# Altium schematic sheet HZSneckV1.2.SchDoc
size 381 x 241 mm; SheetNumber: 1; SheetTotal: 1
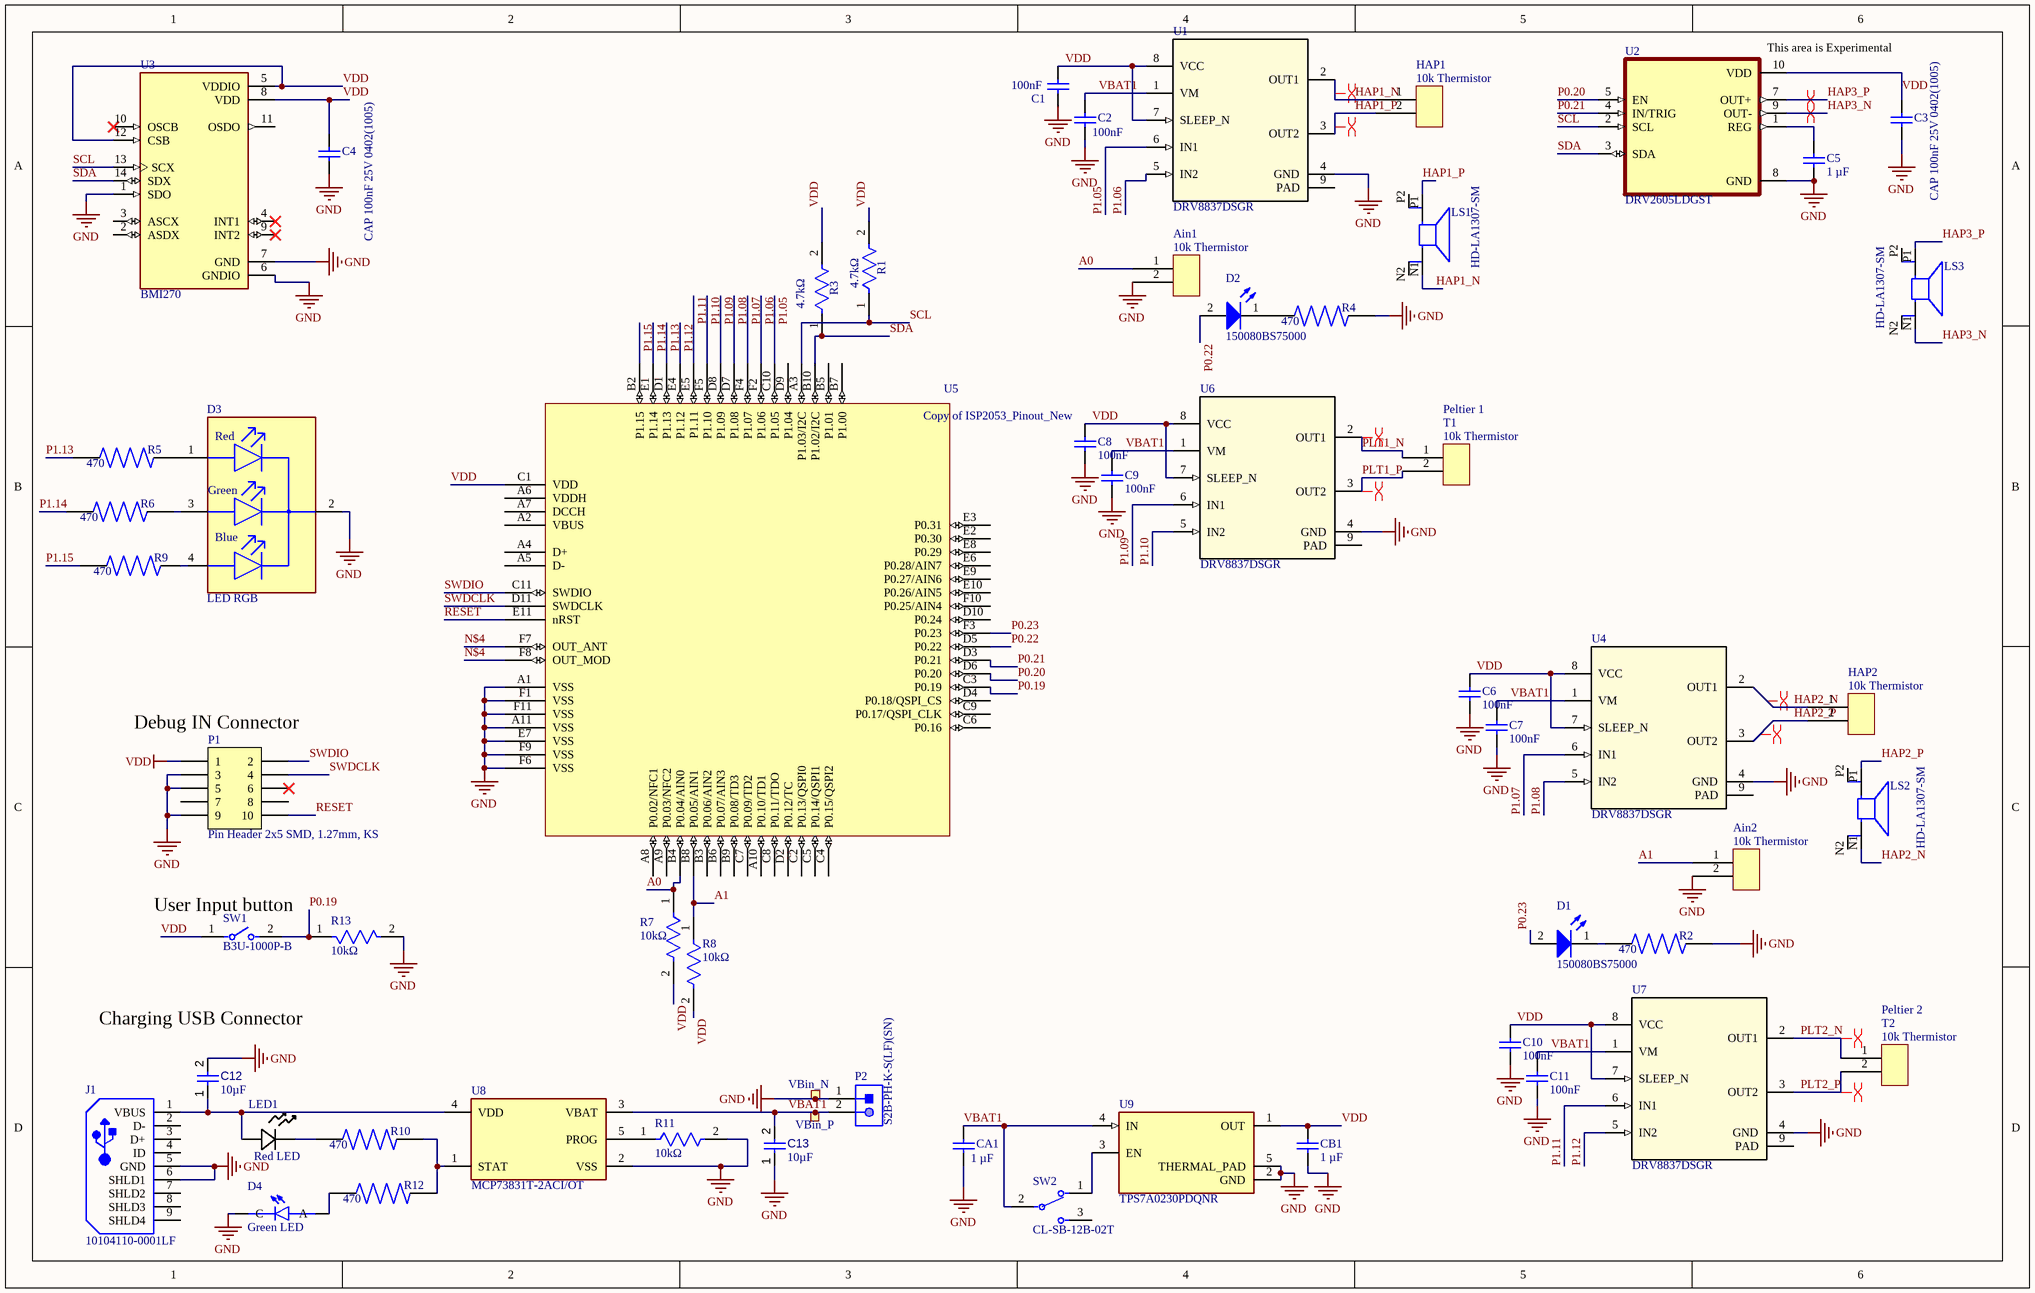
[diagram p0: HZSneckV1.2.SchDoc]

## Parts
Ain1  10k Thermistor Custom  [10k Thermistor Pad]  (value not drawn)
Ain2  10k Thermistor Custom  [10k Thermistor Pad]  (value not drawn)
C1  100nF  [CAPC0402(1005)60_L]
C2  100nF  [CAPC0402(1005)60_L]
C3  CAP 100nF 25V 0402(1005)  [CAPC0402(1005)60_L]
C4  CAP 100nF 25V 0402(1005)  [CAPC0402(1005)60_L]
C5  1 µF  [CAPC1005X56X25ML10T15]
C6  100nF  [CAPC0402(1005)60_L]
C7  100nF  [CAPC0402(1005)60_L]
C8  100nF  [CAPC0402(1005)60_L]
C9  100nF  [CAPC0402(1005)60_L]
C10  100nF  [CAPC0402(1005)60_L]
C11  100nF  [CAPC0402(1005)60_L]
C12  value 10µF  [CAPC0402(1005)60_L]  (hidden comment: Capacitor 10µF +/-40% 6.3V 0402)
C13  value 10µF  [CAPC0402(1005)60_L]  (hidden comment: Capacitor 10µF +/-40% 6.3V 0402)
CA1  1 µF  [CAPC1005X56X25ML10T15]
CB1  1 µF  [CAPC1005X56X25ML10T15]
D1  150080BS75000  [WL-SMCW_0805_150080xx75000]
D2  150080BS75000  [WL-SMCW_0805_150080xx75000]
D3  LED RGB  [FP-AAA3528LSEKJ3ZGKQBKS-MFG]
D4  Green LED  [LEDC2012X120N]
HAP1  10k Thermistor Custom  [10k Thermistor Pad]  (value not drawn)
HAP2  10k Thermistor Custom  [10k Thermistor Pad]  (value not drawn)
J1  10104110-0001LF  [FCI-10104110-0001LF_V]
LED1  Red LED  [LED_LS R976_AOS]
LS1  HD-LA1307-SM  [XDCR_HD-LA1307-SM]
LS2  HD-LA1307-SM  [XDCR_HD-LA1307-SM]
LS3  HD-LA1307-SM  [XDCR_HD-LA1307-SM]
P1  Pin Header 2x5 SMD, 1.27mm, KS  [HDR_2x5-SMD-1.27mm-K]
P2  S2B-PH-K-S(LF)(SN)  [JST-S2B-PH-K-S_V]
R1  4.7kΩ  [FP-TFCR0603-MFG]
R2  value 470  [RESC1608X55N]  (hidden comment: SG73P1JTTD4700F)
R3  4.7kΩ  [FP-TFCR0603-MFG]
R4  value 470  [RESC1608X55N]  (hidden comment: SG73P1JTTD4700F)
R5  value 470  [RESC1608X55N]  (hidden comment: SG73P1JTTD4700F)
R6  value 470  [RESC1608X55N]  (hidden comment: SG73P1JTTD4700F)
R7  10kΩ  [FP-AC0603-IPC_A]
R8  10kΩ  [FP-AC0603-IPC_A]
R9  value 470  [RESC1608X55N]  (hidden comment: SG73P1JTTD4700F)
R10  value 470  [RESC1608X55N]  (hidden comment: SG73P1JTTD4700F)
R11  10kΩ  [FP-AC0603-IPC_A]
R12  value 470  [RESC1608X55N]  (hidden comment: SG73P1JTTD4700F)
R13  10kΩ  [FP-AC0603-IPC_A]
SW1  B3U-1000P-B  [FP-B3U-1000P-B-MFG]
SW2  CL-SB-12B-02T  [FP-CL-SB-12B-02T-MFG]
T1  Peltier 1  [10k Thermistor Pad]
T2  Peltier 2  [10k Thermistor Pad]
U1  DRV8837DSGR  [DSG0008A]
U2  DRV2605LDGST  [SOP50P490X110-10N]
U3  BMI270  [XDCR_BMI270]
U4  DRV8837DSGR  [DSG0008A]
U5  Copy of ISP2053_Pinout_New  [Copy of ISP2053-AX]
U6  DRV8837DSGR  [DSG0008A]
U7  DRV8837DSGR  [DSG0008A]
U8  MCP73831T-2ACI/OT  [FP-C04-091-OT-IPC_B]
U9  TPS7A0230PDQNR  [IC_TPS7A0230PDQNR]
VBin_N  TP_SMD_Ø1.0MM  [TP_SMD_Ø1.0mm]  (value not drawn)  (no BOM)
VBin_P  TP_SMD_Ø1.0MM  [TP_SMD_Ø1.0mm]  (value not drawn)  (no BOM)

## Nets
GND: Ain1.2 Ain2.2 C1.1 C2.1 C3.1 C4.1 C5.1 C6.1 C7.1 C8.1 C9.1 C10.1 C11.1 C12.2 C13.1 CA1.1 CB1.1 D3.2(COMMON_CATHODE) D4.C J1.5(GND) J1.6(SHLD1) P1.3 P1.5 P1.9 P2.1 R2.2 R4.2 R11.2 R13.2 U1.4(GND) U2.8(GND) U3.1(SDO) U3.6(GNDIO) U3.7(GND) U4.4(GND) U5.A1(VSS) U5.A11(VSS) U5.E7(VSS) U5.F1(VSS) U5.F6(VSS) U5.F9(VSS) U5.F11(VSS) U6.4(GND) U7.4(GND) U8.2(VSS) U9.2(GND) U9.5(THERMAL_PAD) VBin_N.1
VDD: C1.2 C3.2 C4.2 C6.2 C8.2 C10.2 CB1.2 P1.1 R1.2 R3.2 R7.2 R8.2 SW1.1 U1.7(SLEEP_N) U1.8(VCC) U2.10(VDD) U3.5(VDDIO) U3.8(VDD) U3.12(CSB) U4.7(SLEEP_N) U4.8(VCC) U5.C1(VDD) U6.7(SLEEP_N) U6.8(VCC) U7.7(SLEEP_N) U7.8(VCC) U9.1(OUT)
A0: Ain1.1 R7.1 U5.B4(P0.04/AIN0)
A1: Ain2.1 R8.1 U5.B8(P0.05/AIN1)
HAP1_N: HAP1.1 LS1.N1 U1.2(OUT1)
HAP1_P: HAP1.2 LS1.P1 U1.3(OUT2)
HAP2_N: HAP2.1 LS2.N1 U4.2(OUT1)
HAP2_P: HAP2.2 LS2.P1 U4.3(OUT2)
HAP3_N: LS3.N1 U2.9(OUT-)
HAP3_P: LS3.P1 U2.7(OUT+)
N$4: U5.F7(OUT_ANT) U5.F8(OUT_MOD)
P0.19: R13.1 SW1.2 U5.C3(P0.19)
P0.20: U2.5(EN) U5.D6(P0.20)
P0.21: U2.4(IN/TRIG) U5.D3(P0.21)
P0.22: D2.2(A) U5.D5(P0.22)
P0.23: D1.2(A) U5.F3(P0.23)
P1.05: U1.6(IN1) U5.C10(P1.05)
P1.06: U1.5(IN2) U5.F2(P1.06)
P1.07: U4.6(IN1) U5.F4(P1.07)
P1.08: U4.5(IN2) U5.D7(P1.08)
P1.09: U5.D8(P1.09) U6.6(IN1)
P1.10: U5.F5(P1.10) U6.5(IN2)
P1.11: U5.E5(P1.11) U7.6(IN1)
P1.12: U5.E4(P1.12) U7.5(IN2)
P1.13: R5.1 U5.D1(P1.13)
P1.14: R6.1 U5.E1(P1.14)
P1.15: R9.1 U5.B2(P1.15)
PLT1_N: T1.1 U6.2(OUT1)
PLT1_P: T1.2 U6.3(OUT2)
PLT2_N: T2.1 U7.2(OUT1)
PLT2_P: T2.2 U7.3(OUT2)
RESET: P1.10 U5.E11(nRST)
SCL: R1.1 U2.2(SCL) U3.13(SCX) U5.A3(P1.03/I2C)
SDA: R3.1 U2.3(SDA) U3.14(SDX) U5.B10(P1.02/I2C)
SWDCLK: P1.4 U5.D11(SWDCLK)
SWDIO: P1.2 U5.C11(SWDIO)
VBAT1: C2.2 C7.2 C9.2 C11.2 C13.2 CA1.2 P2.2 SW2.2(C) U1.1(VM) U4.1(VM) U6.1(VM) U7.1(VM) U8.3(VBAT) U9.4(IN) VBin_P.1
NetC5_2: C5.2 U2.1(REG)
NetC12_1: C12.1 J1.1(VBUS) LED1.2 U8.4(VDD)
NetD1_1: D1.1(K) R2.1
NetD2_1: D2.1(K) R4.1
NetD3_1: D3.1(ANODE_RED) R5.2
NetD3_3: D3.3(ANODE_GREEN) R6.2
NetD3_4: D3.4(ANODE_BLUE) R9.2
NetD4_A: D4.A R12.1
NetLED1_1: LED1.1 R10.1
NetR10_2: R10.2 R12.2 U8.1(STAT)
NetR11_1: R11.1 U8.5(PROG)
NetSW2_1: SW2.1 U9.3(EN)

Not connected (* = marked no-connect by the designer): J1 2(D-) 3(D+) 4(ID) 7(SHLD2) 8(SHLD3) 9(SHLD4); LS1 N2 P2; LS2 N2 P2; LS3 N2 P2; P1 6* 7 8; SW2 3; U1 9(PAD); U3 2(ASDX) 3(ASCX) 4(INT1)* 9(INT2)* 10(OSCB)* 11(OSDO); U4 9(PAD); U5 A2(VBUS) A4(D+) A5(D-) A6(VDDH) A7(DCCH) A8(P0.02/NFC1) A9(P0.03/NFC2) A10(P0.10/TD1) B3(P0.06/AIN2) B5(P1.01) B6(P0.07/AIN3) B7(P1.00) B9(P0.08/TD3) C2(P0.13/QSPI0) C4(P0.15/QSPI2) C5(P0.14/QSPI1) C6(P0.16) C7(P0.09/TD2) C8(P0.11/TDO) C9(P0.17/QSPI_CLK) D2(P0.12/TC) D4(P0.18/QSPI_CS) D9(P1.04) D10(P0.24) E2(P0.30) E3(P0.31) E6(P0.28/AIN7) E8(P0.29) E9(P0.27/AIN6) E10(P0.26/AIN5) F10(P0.25/AIN4); U6 9(PAD); U7 9(PAD)

## Layout directives
differential pair: HAP1_N, HAP1_P, HAP2_N, HAP2_P, HAP3_N, HAP3_P, PLT1_N, PLT1_P, PLT2_N, PLT2_P

## Notes on the sheet
- (near U2) This area is Experimental
- (near D3) Green
- (near D3) Red
- (near D3) Blue
- (near P1) Debug IN Connector
- User Input button
- (near C12) Charging USB Connector
- (in symbol CMP-00000-1) 10k Thermistor

## Library data of the parts
Ain1 Ain2 HAP1 HAP2 T1 T2 = CMP-00000-1: Custom Pad for the Thermistor
C1-C4 C6-C11 = CMP-1034-02073-1: CAP 100nF 25V ±20% 0402 (1005 Metric) Thickness 0.6mm SMD; Tolerance: Â±20%; Case-EIA: 0402; Case-Metric: 1005; Rated Voltage: 25 V; Value: 100nF; Max Thickness: 0.6 mm; Technology: SMT
C5 CA1 CB1 = CMP-2008-02745-1: 1 µF ±10% 6.3V Ceramic Capacitor X5R 0402 (1005 Metric) / 04026D105KAT4A; Manufacturer: AVX Interconnect / Elco; Part Number: 04026D105KAT4A
C12 C13 = CMP-001-00074-3: Chip Capacitor, 10µF +/-40%, 6.3V, 0402, Thickness 0.6 mm; Tolerance: 10%; Case/Package: 0402; Pins: 2; Mounting Technology: SMT; Voltage Rating: 6.3V; Max Operating Temperature: 85°C; Min Operating Temperature: -55°C
D1 D2 = CMP-1426-00008-7: Led, Blue, 470 Nm, 3.2 V, 30 Ma, 145 Mcd Rohs Compliant: Yes; Dominant Wavelength: 470nm; Max Junction Temperature (Tj): 95°C; Power Dissipation: 105mW; Peak Wavelength: 465nm; Max Reverse Voltage (DC): 5V; Forward Current: 100mA; Test Current: 20mA; Luminous Intensity: 145mcd; Lens Style: Clear, Rectangular; Viewing Angle: 140°; Forward Voltage: 3.2V; Color: Blue; Height: 700µm; Case Code (Imperial): 0805; Width: 1.25mm; REACH SVHC: Unknown; Case/Package: 0805; Lead Free: Lead Free; Mount: Surface Mount; Packaging: Tape and Reel; RoHS: Compliant; Reverse Voltage: 5V; Min Operating Temperature: -40°C; Case Code (Metric): 2012; Wavelength: 470nm; Max Operating Temperature: 85°C; Length: 2mm
D3 = CMP-44529-000057-1: LED RGB CLEAR 4SMD / AAA3528LSEKJ3ZGKQBKS; Forward Voltage: 2.7V; Lens Color: Colorless; Luminous Intensity: 30mcd; Viewing Angle: 120°; Color: Blue; Test Current: 2mA; Dominant Wavelength: 465nm; Packaging: Tape and Reel; Width: 2.8mm; Height: 2.1mm; Lens Transparency: Clear; Mount: Surface Mount; Case/Package: PLCC; Length: 3.2mm; RoHS Compliant: Yes
D4 = CMP-004-00034-1: Green LED, 565 nm 0805Diffused, Rectangle Lens SMD package / SML-LXT0805GW-TR; MF: Lumex Opto/Components; Component Type: Standard; Value: *; MP: SML-LXT0805GW-TR; Source: SML-LXT0805GW-TR.SchLib; Design Item ID: SML-LXT0805GW-TR; Check_prices: https://www.snapeda.com/parts/SML-LXT0805GW-TR/Lumex/view-part/?ref=eda; SnapEDA_Link: https://www.snapeda.com/parts/SML-LXT0805GW-TR/Lumex/view-part/?ref=snap; Pins: 2; Case/Package: 0805 Lumex
J1 = CMP-2000-05823-1: Micro USB, Receptacle, -55 to 85 degC, 5-Pin SMD, RoHS, Tape and Reel; Manufacturer: FCI Electronics; Connector Type: USBMicroB; Contact Termination: SurfaceMountRightAngle; Connector Mounting: PCB; No. of Contacts: 5; Manufacturer URL: http://portal.fciconnect.com/; Contact Plating: Gold; Package Description: 5-Pin Surface Mount Device, Body 8.06 x 5.6 mm, Pitch 0.65 mm; Datasheet URL: http://portal.fciconnect.com/Comergent//fci/drawing/10104110.pdf; Datasheet Version: Rev. C, 03/2011; Package Reference: 10104110-0001LF; Mounting Technology: SurfaceMount; Gender: Receptacle
LED1 = CMP-007-00038-1: LS R976-NR-1; Manufacturer_Name: ams OSRAM; Copyright: Copyright (C) 2025 Ultra Librarian. All rights reserved.; Manufacturer_Part_Number: LS R976-NR-1; Source: LSR976-NR-1.SchLib; Design Item ID: LS R976-NR-1
LS1-LS3 = CMP-052-000000-1: 13X13MM LRA HAPTIC 154HZ; MF: PUI Audio, Inc.; MP: HD-LA1307-SM; Package: None; Component Type: Standard; Pin Count: 4; Design Item ID: HD-LA1307-SM; Source: HD-LA1307-SM.SchLib; Check_prices: https://www.snapeda.com/parts/HD-LA1307-SM/PUI+Audio/view-part/?ref=eda; Value: *; SnapEDA_Link: https://www.snapeda.com/parts/HD-LA1307-SM/PUI+Audio/view-part/?ref=snap
P1 = CMP-002-00075-1: Pin Header 2x5, 1.27mm (50mil), SMD, Keying Shroud; Manufacturer Part Number: 3132-10MS0BK00R1; Manufacturer: W-CON; Part number IPS: 00000009968; Pad Count: 10; Note: N.A.; Artikkelnr Noca: 55010009; ComponentLink1URL: N.A.; ComponentLink2URL: N.A.; Component Class: Connectors; LatestRevisionDate: 2016-04-21; Footprint Doc: HDR_2x5-SMD-1.27mm; Design Item ID: Pin Header 2x5 SMD, 1.27mm, KS; ComponentLink2Description: Supplier link; ComponentLink1Description: Datasheet; Pins: 10; Part Number: Pin Header 2x5 SMD, 1.27mm, KS; Component Type: Standard; HelpURL: \\hizz\pro\app9717\Datasheet\connectors\W-CON\3132-XXMXXBK00XX.pdf; Source: pca10095.SCHLIB; PartId: 100500261; Publisher: Nordic Semiconductor; Value: Pin Header 2x5, 1.27mm; Published: 2016-01-22
P2 = CMP-1755-00004-1: Male Header, Pitch 2 mm, 1 x 2 Position, Height 4.8 mm, Tail Length 3.4 mm, -25 to 85 degC, RoHS, Bulk; Case\Package: Radial; Tolerance: 20%; Capacitance: 10 uF; Voltage Rating (DC): 50 V; Packaging: Bulk; ComponentLink1URL: http://www.jst-mfg.com/product/pdf/eng/ePH.pdf; Radiation Hardening: No; Height: 11 mm; Package Quantity: 200; PackageDescription: Male Header, Pitch 2 mm, 1 x 2 Position, Height 4.8 mm, Tail Length 3.4 mm; PackageReference: S2B-PH-K-S; Diameter: 5 mm; Pins: 2; Mount: Through Hole; Max Operating Temperature: 85 degC; Min Operating Temperature: -40 degC; ComponentLink1Description: Datasheet; DatasheetVersion: Dec-12; Length: 11 mm; Lead Pitch: 2 mm; REACH SVHC: No SVHC; Voltage Rating: 50 V; RoHSCompliant: true
R1 R3 = CMP-250906-225181-1: RES Thin Film,  4.7kΩ, 1%, 0.1W, 50ppm/°C, 0603TFCR0603-10W-C-4701FT-1K
R2 R4-R6 R9 R10 R12 = CMP-009-00201-2: RESISTOR, SURGE, 470 OHM 1% 0603; Source: SG73P1JTTD4700F.SchLib; Component Type: Standard; Case/Package: None; Price: None; Availability: Unavailable; Pins: 2; Design Item ID: SG73P1JTTD4700F; MP: SG73P1JTTD4700F
R7 R8 R11 R13 = CMP-03412-040683-1: RES 10kΩ 5.00% 0.2W 0603 / AC0603JR-7W10KL
SW1 = CMP-08834-000005-1: SWITCH TACTILE SPST-NO 0.05A 12V; Manufacturer: Omron; Operating Force: 1.5N; Contact Current Rating: 50mA; Contact Resistance: 100mΩ; Electromechanical Life: 200000Cycles; Height: 1.75mm; Device Class L2: Switches; Temperature Range High: +70°C; Digikey Description: SWITCH TACTILE SPST-NO 0.05A 12V; Throw Configuration: SPST-NO; Ambient Temperature Range High: +70°C; Temperature: -25°C to +70°C; Lead Free: Yes; ComponentLink2URL: https://omronfs.omron.com/en_US/ecb/products/pdf/en-b3u.pdf; Device Class L3: Tactile Switches; Manufacturer Part Number: B3U-1000P-B; Ambient Temperature Range Low: -25°C; Mount: Surface Mount; Automotive: No; Mouser Description: Tactile Switches Top Actuated with boss w/o ground; Octopart: https://octopart.com/b3u-1000p-b-omron-1057356; RoHS: TRUE; Package: 0; Device Class L1: Electromechanical; Voltage Rating Dc: 12V; Category: Switch; Temperature Range Low: -25°C; ComponentLink2Description: Datasheet
SW2 = CMP-71745-000009-1: SWITCH SLIDE SPDT 200MA 12V; Contact Style: Non-Shorting; Actuator Length: 2mm; Actuator Type: Standard; Switch Function: On-On; Electrical Life: 10000Cycles; Operating Force: 153gf; Actuator Material: Nylon; Throw Configuration: SPDT; Mount: Surface Mount; Termination: Gull Wing; Packaging: Cut Tape; Contact Material: Copper; Max Operating Temperature: 85°C; Switch Travel: 2mm; Voltage Rating (DC): 12V; RoHS Compliant: Yes; Series: CL-SB; Contact Plating: Gold; Current Rating: 200mA; Min Operating Temperature: -40°C
U1 U4 U6 U7 = CMP-037-000001-3: 12-V, 1.8-A H-bridge motor driver 8-WSON -40 to 85; Manufacturer_Name: Texas Instruments; Source: DRV8837DSGR.SchLib; Copyright: Copyright (C) 2025 Ultra Librarian. All rights reserved.; Datasheet: https://www.ti.com/lit/gpn/drv8837; TYPE: TYPE; RefDes: RefDes; Manufacturer_Part_Number: DRV8837DSGR; Design Item ID: DRV8837DSGR
U2 = CMP-039-000000-1: Haptic driver for ERM/LRA with 2-V operation, waveform library & auto-resonance tracking; MF: Texas Instruments; Design Item ID: DRV2605LDGST; Package: VSSOP-10 Texas Instruments; Component Type: Standard; Pin Count: 9; Source: DRV2605LDGST.SchLib; Value: *; MP: DRV2605LDGST; SnapEDA_Link: https://www.snapeda.com/parts/DRV2605LDGST/Texas+Instruments/view-part/?ref=snap; Check_prices: https://www.snapeda.com/parts/DRV2605LDGST/Texas+Instruments/view-part/?ref=eda
U3 = CMP-027-000000-1: Accelerometer, Gyroscope, 6 Axis Sensor IÂ²C, SPI Output; MF: Bosch Sensortec; SnapEDA_Link: https://www.snapeda.com/parts/BMI270/Bosch+Sensortec/view-part/?ref=snap; Package: LGA-14 Bosch Sensortec; Component Type: Standard; MP: BMI270; Pin Count: 14; Purchase-URL: https://pricing.snapeda.com/search/part/BMI270/?ref=eda; Source: BMI270.SchLib; Value: *; Design Item ID: BMI270; Digi-Key_Part_Number: 828-1091-2-ND; Check_prices: https://www.snapeda.com/parts/BMI270/Bosch+Sensortec/view-part/?ref=eda
U5 = CMP-020-00023-1: ISP Smart Bluetooth Module; ISP_PART: ISP1807; DESIG: BLE Module; BOI: QFN 8 x 8; FAB: Insight SiP; Source: ISPlibSch.SchLib; Design Item ID: ISP2053_Pinout_New; Component Type: Standard; Pin Count: 74; BOI-Metric: QFN 8 x 8
U8 = CMP-0133-00143-2: IC CONTROLLR LI-ION 4.2V SOT23-5; Max Power Dissipation: 1.54W; Output Current: 500mA; Max Output Voltage: 4.5V; Number of Outputs: 1; Min Output Voltage: 4.168V; Min Supply Voltage: 3.75V; Max Input Voltage: 6V; Voltage Rating: 4.534V; Drain to Source Resistance: 350mR; Max Operating Temperature: 85°C; Length: 0.122inch; Number of Pins: 5; REACH SVHC: No SVHC; Radiation Hardening: No; Min Operating Temperature: -40°C; Weight: 0.00709oz; Contact Plating: Tin; Termination: SMD/SMT; Case/Package: SOT-23; Mount: Surface Mount; Width: 0.071inch; Packaging: Tape and Reel; Number of Cells: 1; Max Charge Current: 500mA; Height: 0.051inch; Number of Channels: 1; Output Voltage: 4.2V; Max Supply Voltage: 6V; Lead Free: Lead Free
U9 = CMP-035-000000-1: 200-mA, nanopower-IQ (25 nA), low-dropout (LDO) voltage regulator with enable; MF: Texas Instruments; Design Item ID: TPS7A0230PDQNR; SnapEDA_Link: https://www.snapeda.com/parts/TPS7A0230PDQNR/Texas+Instruments/view-part/?ref=snap; Component Type: Standard; Source: TPS7A0230PDQNR.SchLib; Package: X2SON-4 Texas Instruments; MP: TPS7A0230PDQNR; Check_prices: https://www.snapeda.com/parts/TPS7A0230PDQNR/Texas+Instruments/view-part/?ref=eda; Pin Count: 5; Value: *
VBin_N VBin_P = CMP-017-000001-1: 1.0mm circular SMD testpad; Manufacturer: Nordic Semiconductor; Pad Count: 1; Note: N.A.; Value: Ø1.0mm,SMD; Part Number: TP_SMD_Ø1.0MM; Source: pca10095.SCHLIB; ComponentLink1URL: N.A.; Publisher: Nordic Semiconductor; Footprint Doc: TP_SMD_Ø1.0mm; ComponentLink2URL: N.A.; Artikkelnr Noca: N.A.; HelpURL: N.A.; PartId: 100500475; Published: 2013-06-11; Component Class: Connectors; Design Item ID: TP_SMD_Ø1.0MM; Manufacturer Part Number: N.A.; LatestRevisionDate: 2013-06-11; ComponentLink2Description: Supplier link; Part number IPS: N.A.; ComponentLink1Description: Datasheet; Component Type: Standard (No BOM); Pin Count: 1